# Altium project PCB_Project1.PrjPCB
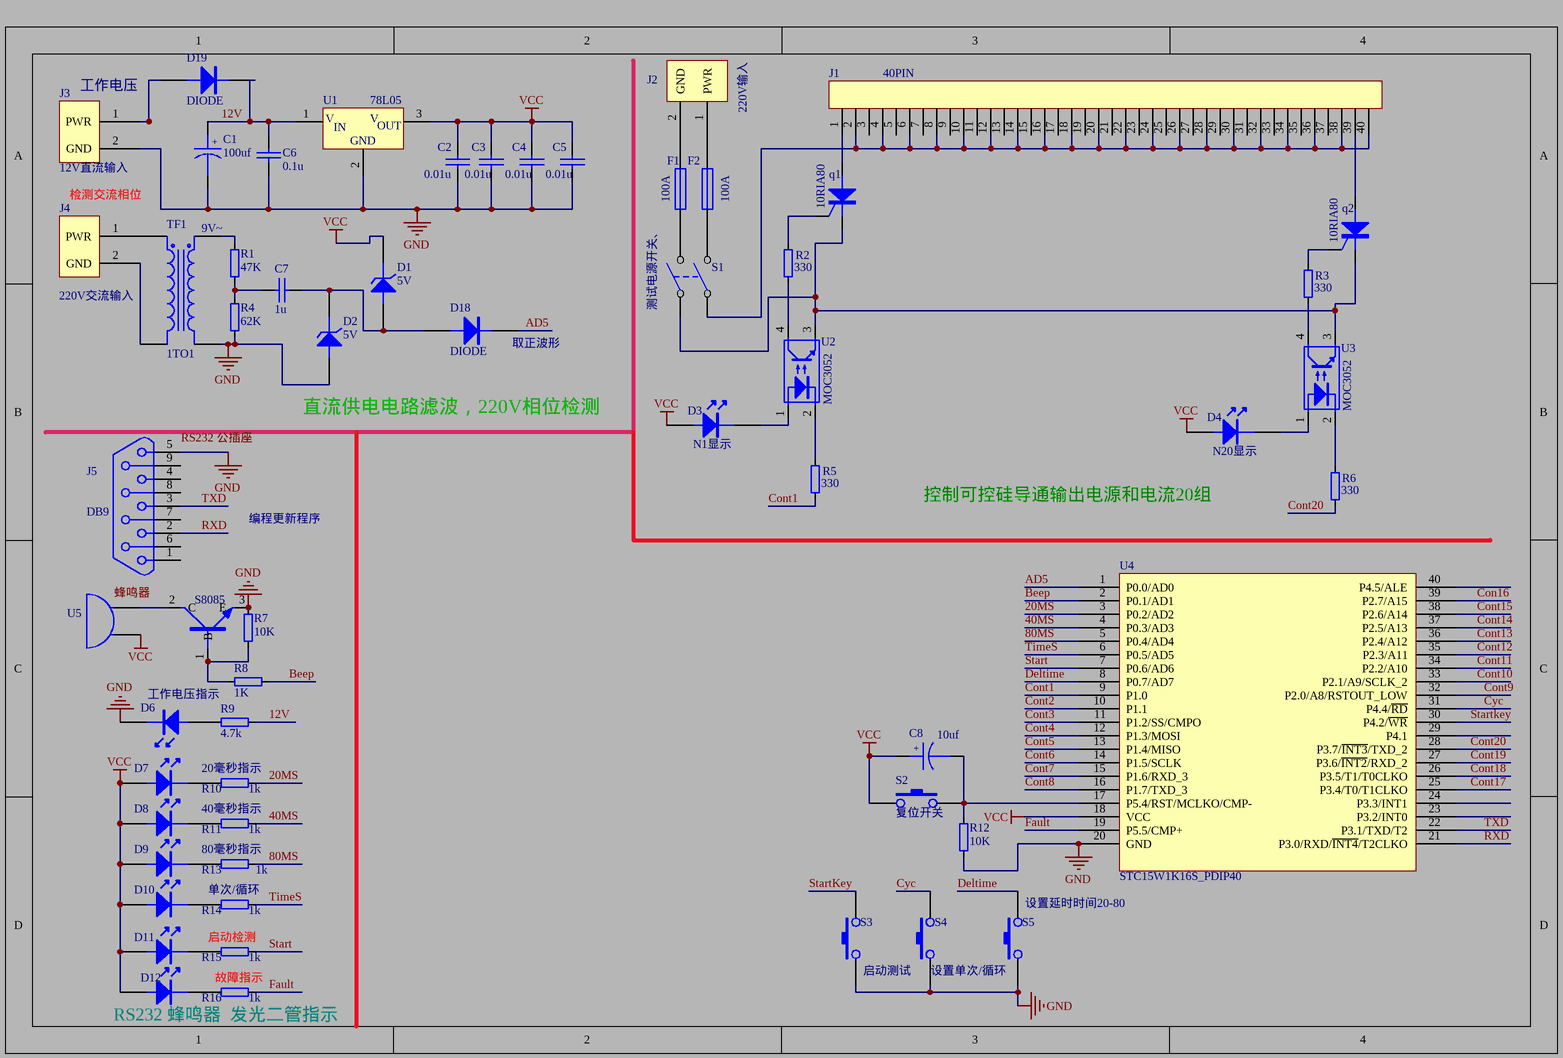
[diagram p0: WT2.SchDoc]
1 sheet, 58 parts. Net scope: global (net labels, ports and power ports of the same name join across sheets).
Board file: WT2.PcbDoc

## Sheet WT2.SchDoc
size A4

### Parts
C1  100uf  [10UF]
C2  0.01u  [RAD0.1]
C3  0.01u  [RAD0.1]
C4  0.01u  [RAD0.1]
C5  0.01u  [RAD0.1]
C6  0.1u  [RAD0.1]
C7  1u  [RAD0.1]
C8  10uf  [100UF]
D1  5V  [Diode0.3]
D2  5V  [DIODE]
D3  N1显示  [DIODE0.4A]
D4  N20显示  [DIODE0.4A]
D6  工作电压指示  [DIODE0.4A]
D7  20毫秒指示  [DIODE0.4A]
D8  40毫秒指示  [DIODE0.4A]
D9  80毫秒指示  [DIODE0.4A]
D10  单次/循环  [DIODE0.4A]
D11  启动检测  [DIODE0.4A]
D12  故障指示  [DIODE0.4A]
D18  DIODE  [Diode0.3]
D19  DIODE  [Diode0.3]
F1  100A  [FUSE]
F2  100A
J1  40PIN  [IDC40]
J2  220V输入
J3  12V直流输入
J4  220V交流输入
J5  DB9  [DB9]
q1  10RIA80
q2  10RIA80
R1  47K  [AXIAL0.3]
R2  330  [AXIAL0.3]
R3  330  [AXIAL0.3]
R4  62K  [AXIAL0.3]
R5  330  [AXIAL0.3]
R6  330  [AXIAL0.3]
R7  10K  [AXIAL0.3]
R8  1K  [AXIAL0.3]
R9  4.7k  [AXIAL0.3]
R10  1k  [AXIAL0.3]
R11  1k  [AXIAL0.3]
R12  10K  [AXIAL0.3]
R13  1k  [AXIAL0.3]
R14  1k  [AXIAL0.3]
R15  1k  [AXIAL0.3]
R16  1k  [AXIAL0.3]
S1  测试电源开关、  [SIP2-2.0]
S2  复位开关  [KBPC106]
S3  启动测试  [KBPC106]
S4  设置单次/循环  [KBPC106]
S5  设置延时时间20-80  [KBPC106]
TF1  1TO1
U1  78L05  [78XX]
U2  MOC3052
U3  MOC3052
U4  STC15W1K16S_PDIP40  [DIP40]
U5  蜂鸣器  [BELL]
  S8085  [TO-92]

### Nets
GND: C1.2 C2.2 C3.2 C4.2 C5.2 C6.2 D2.1(A) D6.K J3.2(GND) J5.5 R4.1 R7.1 R12.1 S3.1 S4.1 S5.1 TF1.4(Sec-) U1.2(GND) U4.20(GND) .3(E)
VCC: C2.1 C3.1 C4.1 C5.1 C8.1 D1.2(K) D3.A D4.A D7.A D8.A D9.A D10.A D11.A D12.A S2.1 U1.3(VOUT) U4.18(VCC) U5.1(A)
12V: C1.1 C6.1 D19.2(K) R9.1 U1.1(VIN)
20MS: R10.1 U4.3(P0.2/AD2)
40MS: R11.1 U4.4(P0.3/AD3)
80MS: R13.1 U4.5(P0.4/AD4)
AD5: D18.2(K) U4.1(P0.0/AD0)
Beep: R8.1 U4.2(P0.1/AD1)
Con16: U4.39(P2.7/A15)
Cont1: R5.1 U4.9(P1.0)
Cont2: U4.10(P1.1)
Cont3: U4.11(P1.2/SS/CMPO)
Cont4: U4.12(P1.3/MOSI)
Cont5: U4.13(P1.4/MISO)
Cont6: U4.14(P1.5/SCLK)
Cont7: U4.15(P1.6/RXD_3)
Cont8: U4.16(P1.7/TXD_3)
Cont9: U4.32(P2.0/A8/RSTOUT_LOW)
Cont10: U4.33(P2.1/A9/SCLK_2)
Cont11: U4.34(P2.2/A10)
Cont12: U4.35(P2.3/A11)
Cont13: U4.36(P2.4/A12)
Cont14: U4.37(P2.5/A13)
Cont15: U4.38(P2.6/A14)
Cont17: U4.25(P3.4/T0/T1CLKO)
Cont18: U4.26(P3.5/T1/T0CLKO)
Cont19: U4.27(P3.6/~{INT2}/RXD_2)
Cont20: R6.1 U4.28(P3.7/~{INT3}/TXD_2)
Cyc: S4.2 U4.31(P4.4/~{RD})
Deltime: S5.2 U4.8(P0.7/AD7)
Fault: R16.1 U4.19(P5.5/CMP+)
RXD: J5.2 U4.21(P3.0/RXD/~{INT4}/T2CLKO)
Start: R15.1 U4.7(P0.6/AD6)
Startkey: S3.2 U4.30(P4.2/~{WR})
TimeS: R14.1 U4.6(P0.5/AD5)
TXD: J5.3 U4.22(P3.1/TXD/T2)
NetC7_1: C7.1 R1.1 R4.2
NetC7_2: C7.2 D1.1(A) D2.2(K) D18.1(A)
NetC8_2: C8.2 R12.2 S2.2 U4.17(P5.4/RST/MCLKO/CMP-)
NetD3_K: D3.K U2.1(LED_Anode)
NetD4_K: D4.K U3.1(LED_Anode)
NetD6_A: D6.A R9.2
NetD7_K: D7.K R10.2
NetD8_K: D8.K R11.2
NetD9_K: D9.K R13.2
NetD10_K: D10.K R14.2
NetD11_K: D11.K R15.2
NetD12_K: D12.K R16.2
NetD19_1: D19.1(A) J3.1(PWR)
NetF1_1: F1.1 S1.2(NO1)
NetF1_2: F1.2 J2.2(GND)
NetF2_1: F2.1 S1.4(NO2)
NetF2_2: F2.2 J2.1(PWR)
NetJ1_1: J1.1 q1.1(A)
NetJ1_2: J1.2 J1.4 J1.6 J1.8 J1.10 J1.12 J1.14 J1.16 J1.18 J1.20 J1.22 J1.24 J1.26 J1.28 J1.30 J1.32 J1.34 J1.36 J1.38 J1.40 S1.3(COMMON2)
NetJ1_39: J1.39 q2.1(A)
NetJ4_1: J4.1(PWR) TF1.1(Pri+)
NetJ4_2: J4.2(GND) TF1.2(Pri-)
Netq1_2: q1.2(G) R2.2
Netq1_3: q1.3(K) q2.3(K) S1.1(COMMON1) U2.3(Emitter) U3.3(Emitter)
Netq2_2: q2.2(G) R3.2
NetR1_2: R1.2 TF1.3(Sec+)
NetR2_1: R2.1 U2.4(Collector)
NetR3_1: R3.1 U3.4(Collector)
NetR5_2: R5.2 U2.2(LED_Cathode)
NetR6_2: R6.2 U3.2(LED_Cathode)
NetR7_2: R7.2 R8.2 .1(B)
NetU5_2: U5.2(B) .2(C)

Not connected (* = marked no-connect by the designer): J1 3 5 7 9 11 13 15 17 19 21 23 25 27 29 31 33 35 37; J5 1 4 6 7 8 9; U4 23(P3.2/INT0) 24(P3.3/INT1) 29(P4.1) 40(P4.5/ALE)

### Notes on the sheet
- (near J3) 工作电压
- 检测交流相位
- (near TF1) 9V~
- (near D18) 取正波形
- (near J5) RS232 公插座
- (near D2) 直流供电电路滤波，220V相位检测
- 编程更新程序
- 控制可控硅导通输出电源和电流20组
- RS232 蜂鸣器  发光二管指示
- (in symbol 78L05) V; IN; OUT
- (in symbol 电解电容) +

### Library data of the parts
C1 C8 = 电解电容: Capacitor
C2-C7 = 普通电容: Capacitor
D1 D2 = ZENER3: Zener Diode
D3 D4 D6-D12 = 发光二极管
F1 F2 = FUSE1: Fuse
J2-J4 = con2: POWER
q1 q2 = 10RIA80: Silicon Controlled Rectifier
R1-R16 = RES
S1 = SW DPST
S2-S5 = 微动开关
TF1 = 1TO1: Transformer
U1 = 78L05: 3-Terminal Positive Voltage Regulator
U2 U3 = Q817
U5 = BUZZER
 = NPNN